# EAGLE design sdram_xxsd_1.0 (EAGLE 9.0.0)
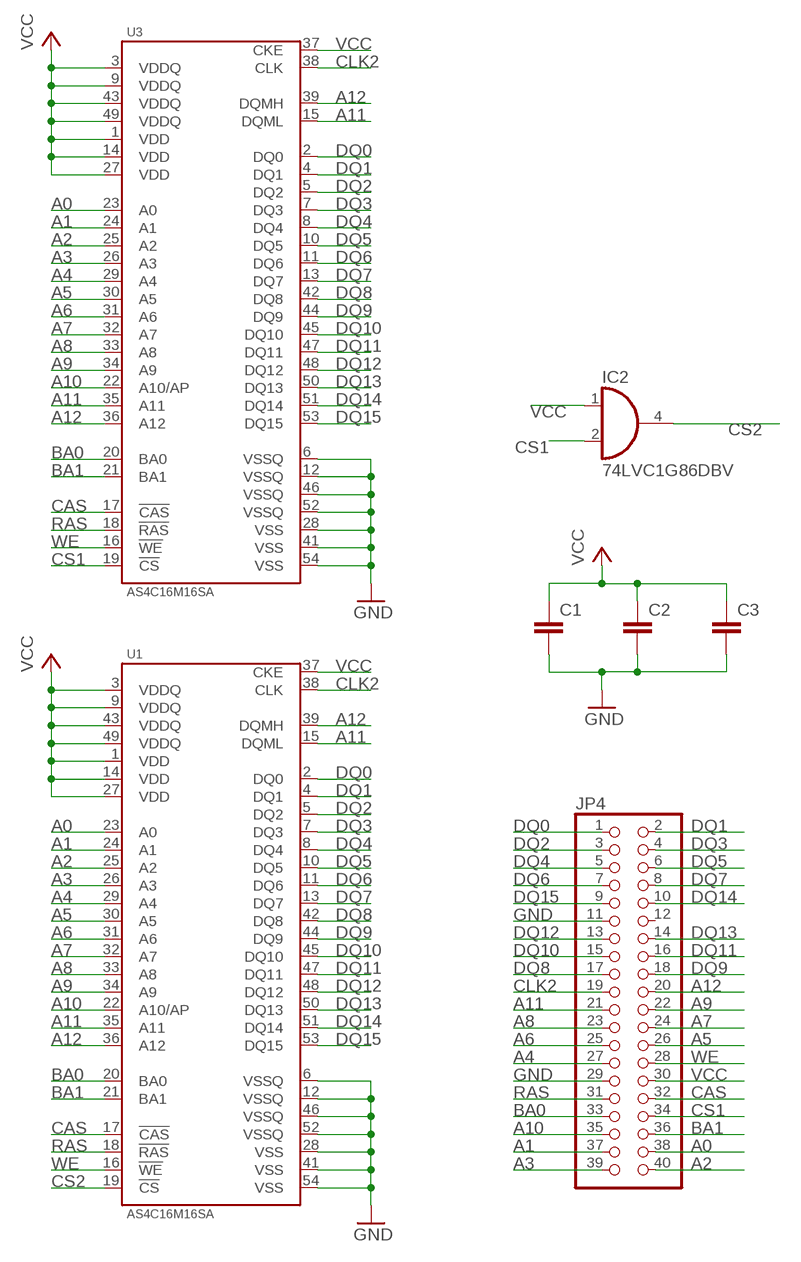
[diagram p0: schematic, sheet 1]

## Parts
C1  C-EUC0805K  [C0805K]
C2  C-EUC0805K  [C0805K]
C3  C-EUC0805K  [C0805K]
IC2  74LVC1G86DBV  74LVC1G08DBV  [SOT23-5]
JP4  PINHD-2X20_2.54-SMD  [2X20SMD]
U1  AS4C16M16SA  [TSOPII-54]
U3  AS4C16M16SA  [TSOPII-54]

## Nets
A0: JP4.38 U1.23(A0) U3.23(A0)
A1: JP4.37 U1.24(A1) U3.24(A1)
A2: JP4.40 U1.25(A2) U3.25(A2)
A3: JP4.39 U1.26(A3) U3.26(A3)
A4: JP4.27 U1.29(A4) U3.29(A4)
A5: JP4.26 U1.30(A5) U3.30(A5)
A6: JP4.25 U1.31(A6) U3.31(A6)
A7: JP4.24 U1.32(A7) U3.32(A7)
A8: JP4.23 U1.33(A8) U3.33(A8)
A9: JP4.22 U1.34(A9) U3.34(A9)
A10: JP4.35 U1.22(A10/AP) U3.22(A10/AP)
A11: JP4.21 U1.15(DQML) U1.35(A11) U3.15(DQML) U3.35(A11)
A12: JP4.20 U1.36(A12) U1.39(DQMH) U3.36(A12) U3.39(DQMH)
BA0: JP4.33 U1.20(BA0) U3.20(BA0)
BA1: JP4.36 U1.21(BA1) U3.21(BA1)
CAS: JP4.32 U1.17(!CAS) U3.17(!CAS)
CLK2 [power]: JP4.19 U1.38(CLK) U3.38(CLK)
CS1: IC2.2(I1) JP4.34 U3.19(!CS)
CS2: IC2.4(O) U1.19(!CS)
DQ0: JP4.1 U1.2(DQ0) U3.2(DQ0)
DQ1: JP4.2 U1.4(DQ1) U3.4(DQ1)
DQ2: JP4.3 U1.5(DQ2) U3.5(DQ2)
DQ3: JP4.4 U1.7(DQ3) U3.7(DQ3)
DQ4: JP4.5 U1.8(DQ4) U3.8(DQ4)
DQ5: JP4.6 U1.10(DQ5) U3.10(DQ5)
DQ6: JP4.7 U1.11(DQ6) U3.11(DQ6)
DQ7: JP4.8 U1.13(DQ7) U3.13(DQ7)
DQ8: JP4.17 U1.42(DQ8) U3.42(DQ8)
DQ9: JP4.18 U1.44(DQ9) U3.44(DQ9)
DQ10: JP4.15 U1.45(DQ10) U3.45(DQ10)
DQ11: JP4.16 U1.47(DQ11) U3.47(DQ11)
DQ12: JP4.13 U1.48(DQ12) U3.48(DQ12)
DQ13: JP4.14 U1.50(DQ13) U3.50(DQ13)
DQ14: JP4.10 U1.51(DQ14) U3.51(DQ14)
DQ15: JP4.9 U1.53(DQ15) U3.53(DQ15)
GND [power]: C1.2 C2.2 C3.2 JP4.11 JP4.29 U1.6(VSSQ) U1.12(VSSQ) U1.28(VSS) U1.41(VSS) U1.46(VSSQ) U1.52(VSSQ) U1.54(VSS) U3.6(VSSQ) U3.12(VSSQ) U3.28(VSS) U3.41(VSS) U3.46(VSSQ) U3.52(VSSQ) U3.54(VSS)
RAS: JP4.31 U1.18(!RAS) U3.18(!RAS)
VCC: C1.1 C2.1 C3.1 IC2.1(I0) JP4.30 U1.1(VDD) U1.3(VDDQ) U1.9(VDDQ) U1.14(VDD) U1.27(VDD) U1.37(CKE) U1.43(VDDQ) U1.49(VDDQ) U3.1(VDD) U3.3(VDDQ) U3.9(VDDQ) U3.14(VDD) U3.27(VDD) U3.37(CKE) U3.43(VDDQ) U3.49(VDDQ)
WE: JP4.28 U1.16(!WE) U3.16(!WE)
Unconnected: JP4.12

## Power pins joined to a net without a drawn wire
GND: IC2.3(GND)
VCC: IC2.5(VCC)

## Library data of the parts
C1-C3 = rcl:C-EU: CAPACITOR, European symbol
IC2 = 74xx-little-de:74*1G08: 2-input AND gate
JP4 = pinhead-2:PINHD-2X20: PIN HEADER
U1 U3 = AllianceMemory:AS4C16M16SA

## Net classes
0 default: width 0.178 mm, clearance 0.178 mm
1 power: width 0.305 mm, clearance 0.178 mm to class 0, clearance 0.229 mm

## Board
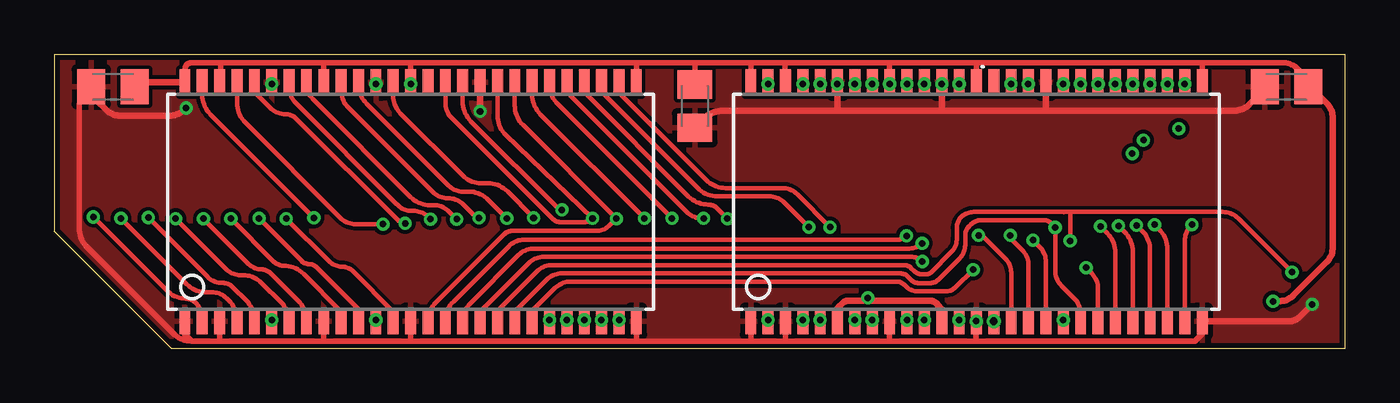
[diagram p1: board, top side]
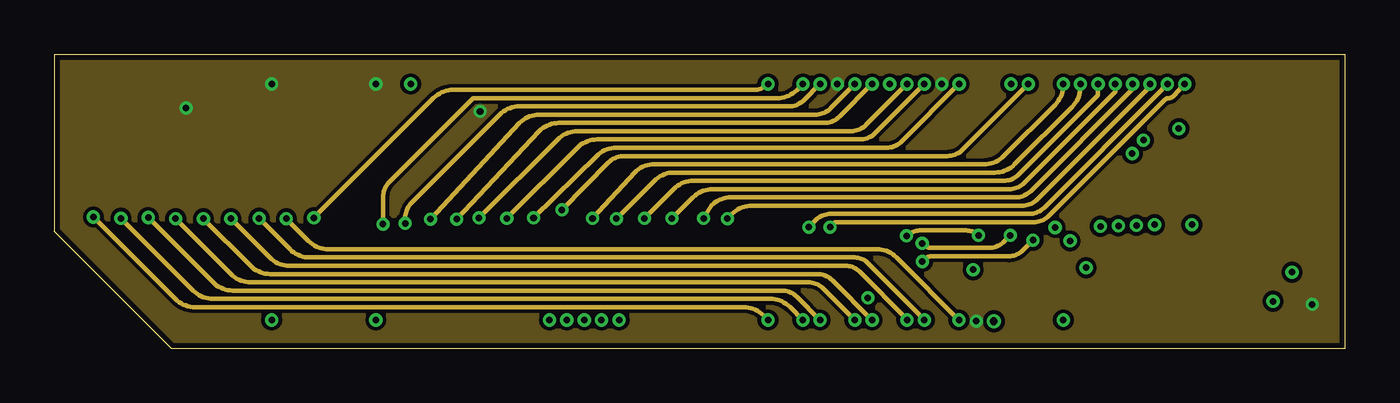
[diagram p2: board, inner layer Route2]
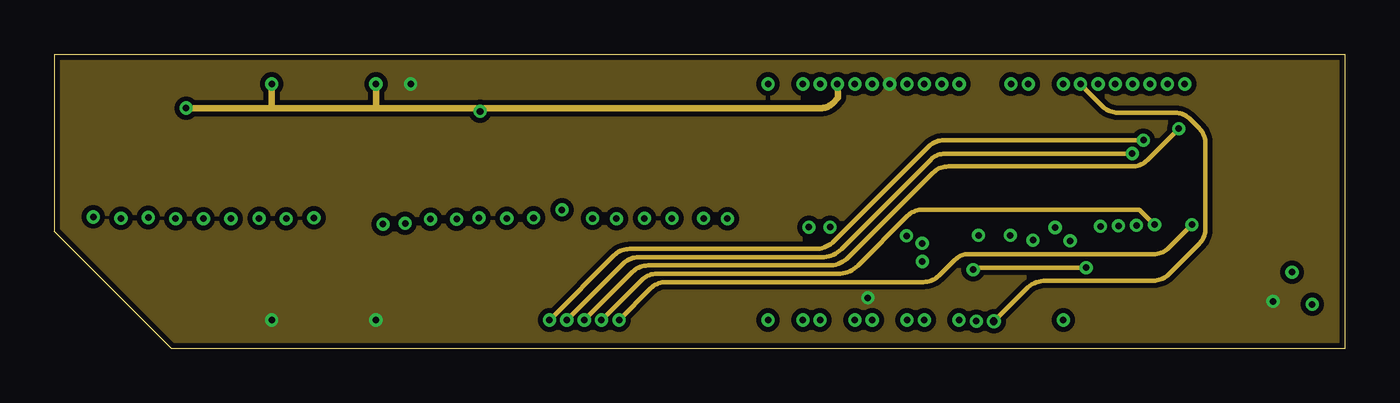
[diagram p3: board, inner layer Route15]
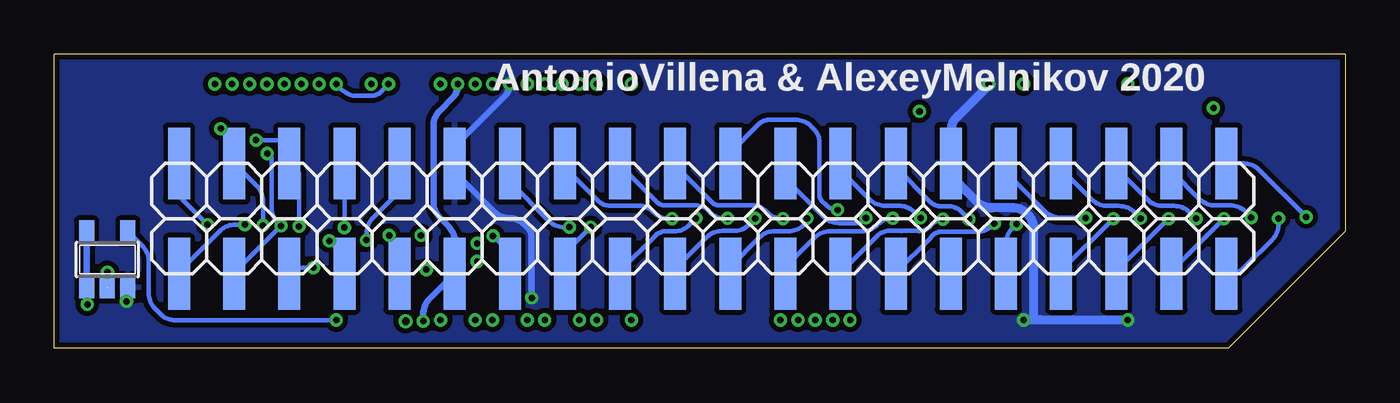
[diagram p4: board, bottom side, seen from below]

Size 59.49 x 13.55 mm. Coordinates in mm from the lower left corner, seen from the top.
Outline: 59.49,0 59.49,13.55 0,13.55 0,5.4 5.4,0 59.49,0
Copper layers (1*2*15*16): Top 0.035mm / dielectric 0.2mm / Route2 0.0175mm / dielectric 1.065mm / Route15 0.0175mm / dielectric 0.2mm / Bottom 0.035mm
Design rules "seedstudio_Fusion_eagle_rule_v1.1 *": minimum track width 6mil, minimum drill 12mil, track to track 6mil, track to pad 6mil, pad to pad 6mil, via to via 6mil, smd to smd 0mil, copper to edge 10mil, drill to drill 10mil, minimum pad ring 10mil, minimum via ring 6mil, stop-mask expansion 2mil, vias tented up to drill 100mil, thermal gap 10mil

### Footprints (pad centres in the part's own frame; a part is rotated, then mirrored left to right if it is on the bottom)
C0805K = smd 1.3 x 1.6: 1 -1,0; 2 1,0
SOT23-5 = smd 0.69 x 0.99: 1 -0.95,-1.29; 2 0,-1.29; 3 0.95,-1.29; 4 0.95,1.3; 5 -0.95,1.3
2X20SMD = smd 1.016 x 3.302: 1 -1.27,-3.81; 2 -1.27,1.27; 3 1.27,-3.81; 4 1.27,1.27; 5 3.81,-3.81; 6 3.81,1.27; 7 6.35,-3.81; 8 6.35,1.27; 9 8.89,-3.81; 10 8.89,1.27; 11 11.43,-3.81; 12 11.43,1.27; 13 13.97,-3.81; 14 13.97,1.27; 15 16.51,-3.81; 16 16.51,1.27; 17 19.05,-3.81; 18 19.05,1.27; 19 21.59,-3.81; 20 21.59,1.27; 21 24.13,-3.81; 22 24.13,1.27; 23 26.67,-3.81; 24 26.67,1.27; 25 29.21,-3.81; 26 29.21,1.27; 27 31.75,-3.81; 28 31.75,1.27; 29 34.29,-3.81; 30 34.29,1.27; 31 36.83,-3.81; 32 36.83,1.27; 33 39.37,-3.81; 34 39.37,1.27; 35 41.91,-3.81; 36 41.91,1.27; 37 44.45,-3.81; 38 44.45,1.27; 39 46.99,-3.81; 40 46.99,1.27
TSOPII-54 = smd 0.5 x 1.2: 1 -9.13,-6.772; 2 -8.33,-6.772; 3 -7.53,-6.772; 4 -6.73,-6.772; 5 -5.93,-6.772; 6 -5.13,-6.772; 7 -4.33,-6.772; 8 -3.53,-6.772; 9 -2.73,-6.772; 10 -1.93,-6.772; 11 -1.13,-6.772; 12 -0.33,-6.772; 13 0.47,-6.772; 14 1.27,-6.772; 15 2.07,-6.772; 16 2.87,-6.772; 17 3.67,-6.772; 18 4.47,-6.772; 19 5.27,-6.772; 20 6.07,-6.772; 21 6.87,-6.772; 22 7.67,-6.772; 23 8.47,-6.772; 24 9.27,-6.772; 25 10.07,-6.772; 26 10.87,-6.772; 27 11.67,-6.772; 28 11.67,4.232; 29 10.87,4.232; 30 10.07,4.232; 31 9.27,4.232; 32 8.47,4.232; 33 7.67,4.232; 34 6.87,4.232; 35 6.07,4.232; 36 5.27,4.232; 37 4.47,4.232; 38 3.67,4.232; 39 2.87,4.232; 40 2.07,4.232; 41 1.27,4.232; 42 0.47,4.232; 43 -0.33,4.232; 44 -1.13,4.232; 45 -1.93,4.232; 46 -2.73,4.232; 47 -3.53,4.232; 48 -4.33,4.232; 49 -5.13,4.232; 50 -5.93,4.232; 51 -6.73,4.232; 52 -7.53,4.232; 53 -8.33,4.232; 54 -9.13,4.232

### Placement (x,y rotation side)
C1  2.71,12.05 0 top
C2  56.78,12.05 0 top
C3  29.51,11.16 90 top
IC2  57.05,4.1 0 bottom
JP4  6.74,4.71 180 bottom
U1  41.22,8.03 0 top
U3  15.15,8.03 0 top

### Tracks (layer width: path | path; a pad name or v marks a point on that pad's centre or on a via)
A0  (via drill 0.3)
  Top 0.203: v49.04,5.65 49.32,5.36 arc-45 49.69,4.46 U1.23 | U3.23 23.62,1.3 arc45 v23.62,1.31
  Route15 0.203: v49.67,8.98 41.38,8.97 41.03,8.97 arc45 40.39,8.7 36.26,4.58 arc-45 35.36,4.2 26.92,4.2 arc45 26.22,3.91 v23.62,1.31
  Bottom 0.203: 49.04,5.6 v49.04,5.65 | v49.67,8.98 49.48,8.79 49.48,6.51 arc-45 49.19,5.8 v49.04,5.65 | v49.04,5.65 51.19,3.49 JP4.38
A1  (via drill 0.3)
  Top 0.203: v49.87,5.67 50.12,5.42 arc-45 50.49,4.52 U1.24 | U3.24 24.42,1.21 v24.42,1.31
  Route15 0.203: v51.82,10.12 50.37,8.68 arc-45 49.66,8.38 41.2,8.38 arc45 40.49,8.09 36.59,4.2 arc-45 35.69,3.82 27.35,3.82 arc45 26.64,3.53 v24.42,1.31
  Bottom 0.203: v51.82,10.12 51.19,9.5 JP4.37 50.16,7.49 arc45 49.87,6.78 v49.87,5.67
A2  (via drill 0.3)
  Top 0.203: v50.7,5.7 50.92,5.48 arc-45 51.29,4.58 U1.25 | 25.23,1.25 U3.25 v25.22,1.3 arc45 v25.22,1.31
  Route15 0.203: 25.23,1.23 v25.22,1.31 27.06,3.15 arc-45 27.76,3.44 36.13,3.44 arc45 37.02,3.81 39.32,6.11 arc-45 40.03,6.4 50,6.4 v50.7,5.7
  Bottom 0.203: JP4.40 53.73,3.54 51.87,5.41 arc45 51.16,5.7 v50.7,5.7
A3  (via drill 0.3)
  Top 0.203: U3.26 26.02,1.23 v26.02,1.31 | v52.42,5.7 52.39,5.66 arc45 52.09,4.96 U1.26
  Route15 0.203: v26.02,1.31 27.48,2.77 arc-45 28.19,3.06 40.06,3.06 arc45 40.77,3.35 41.51,4.09 arc-45 42.11,4.34 50.65,4.34 arc45 51.36,4.64 v52.42,5.7
  Bottom 0.203: JP4.39 53.73,7.01 v52.42,5.7
A4  (via drill 0.3)
  Top 0.203: U3.29 26.02,11.77 30.03,7.76 arc45 30.93,7.39 33.54,7.39 arc-45 34.25,7.1 v35.75,5.59 | U1.29 v52.09,12.18
  Route2 0.203: v52.09,12.18 51.88,11.96 51.88,11.94 51.54,11.61 | v35.75,5.59 35.98,5.82 45.13,5.82 arc45 45.83,6.11 51.18,11.46 arc-45 51.36,11.53 | 51.36,11.53 arc45 51.54,11.61 | 51.36,11.53 arc45 51.54,11.61
  Bottom 0.203: JP4.27 38.49,7.67 36.71,5.88 arc-45 36,5.59 v35.75,5.59
A5  (via drill 0.3)
  Top 0.203: U3.30 25.22,11.81 29.65,7.38 arc45 30.55,7.01 32.94,7.01 arc-45 33.65,6.71 v34.77,5.59 | U1.30 v51.29,12.18
  Route2 0.203: v51.29,12.18 51.07,11.96 51.07,11.94 45.62,6.49 arc-45 44.91,6.2 35.79,6.2 arc45 35.09,5.91 v34.77,5.59
  Bottom 0.203: JP4.26 35.95,4.41 v34.77,5.59
A6  (via drill 0.3)
  Top 0.203: v31.01,5.98 30.53,6.46 arc45 30.13,6.63 arc-45 29.24,7 24.42,11.81 U3.31 | 50.47,12.24 U1.31 v50.49,12.18
  Route2 0.203: v31.01,5.98 31.24,6.21 arc-45 32.14,6.58 44.59,6.58 arc45 45.3,6.87 50.49,12.06 v50.49,12.18
  Bottom 0.203: 35.95,8.27 JP4.25 35.95,8.33 34.42,6.8 arc-45 33.89,6.58 32.58,6.58 arc45 31.88,6.29 31.84,6.25 arc-45 31.19,5.98 v31.01,5.98
A7  (via drill 0.3)
  Top 0.203: v29.92,5.99 arc-45 29.2,6.23 23.89,11.54 23.89,11.55 23.62,11.82 U3.32 | 49.67,12.24 U1.32 49.69,12.25 v49.69,12.18
  Route2 0.203: v29.92,5.99 30.29,6.59 arc-45 31.18,6.96 44.29,6.96 arc45 45,7.25 49.69,11.94 v49.69,12.18
  Bottom 0.203: 29.92,6.01 v29.92,5.99 30.25,5.66 arc45 30.89,5.4 31.32,5.4 arc-45 31.77,5.21 33.41,3.57 JP4.24
A8  (via drill 0.3)
  Top 0.203: v28.46,5.99 23.19,11.26 arc-45 22.82,12.16 U3.33 | 48.88,12.24 U1.33 v48.89,12.18
  Route2 0.203: v28.46,5.99 29.43,6.97 arc-45 30.33,7.34 44,7.34 arc45 44.7,7.63 48.89,11.82 v48.89,12.18
  Bottom 0.203: JP4.23 33.41,8.43 31.72,6.74 arc-45 31.37,6.59 29.95,6.59 arc45 29.32,6.33 29.22,6.24 arc-45 28.64,5.99 v28.46,5.99
A9  (via drill 0.3)
  Top 0.203: v27.19,5.99 22.39,10.79 arc-45 22.02,11.69 U3.34 | 48.07,12.24 U1.34 v48.1,12.18
  Route2 0.203: v27.19,5.99 28.55,7.35 arc-45 29.44,7.72 43.74,7.72 arc45 44.45,8.01 48.1,11.66 v48.1,12.18
  Bottom 0.203: JP4.22 30.87,3.67 29.42,5.12 arc45 28.72,5.41 28.16,5.41 arc-45 27.5,5.68 v27.19,5.99
A10  (via drill 0.3)
  Top 0.203: v48.2,5.62 48.52,5.3 arc-45 48.89,4.41 U1.22 | U3.22 v22.82,1.31
  Route15 0.203: v50.19,9.59 40.99,9.59 arc45 40.29,9.3 35.94,4.95 arc-45 35.06,4.58 26.51,4.58 arc45 25.8,4.29 v22.82,1.31
  Bottom 0.203: v48.2,5.62 48.2,8.07 JP4.35 48.65,9.31 48.94,9.59 v50.19,9.59
A11  (via drill 0.3, 0.35)
  Top 0.203: 17.22,1.32 U3.15 arc-45 17.57,2.1 20.73,5.26 arc-45 21.09,5.41 21.1,5.42 24.39,5.42 24.4,5.41 24.97,5.41 arc45 25.6,5.67 v25.91,5.98 21.59,10.3 arc-45 21.22,11.2 U3.35 | U1.35 v47.29,12.18
  Route2 0.203: v25.91,5.98 27.66,7.73 arc-45 28.55,8.1 43.35,8.1 arc45 44.25,8.47 46.92,11.14 arc45 47.29,12.04 v47.29,12.18
  Route15 0.203: U1.15 44.79,2.75 arc-45 45.69,3.12 50.64,3.12 arc45 51.35,3.42 52.75,4.83 arc45 53.05,5.53 53.05,9.43 arc45 52.76,10.13 52.29,10.6 arc45 51.66,10.86 49.01,10.86 arc-45 48.3,11.15 47.51,11.94 47.51,11.96 v47.29,12.18
  Bottom 0.203: 30.8,8.43 30.87,8.43 JP4.21 arc-45 30.81,8.37 29.16,6.72 arc-45 28.85,6.59 | v25.91,5.98 25.97,5.98 arc45 26.63,6.25 26.71,6.34 arc-45 27.31,6.59 28.85,6.59 | 28.85,6.59 28.96,6.59
  other vias: 43.29,1.25
A12  (via drill 0.3)
  Top 0.203: U1.39 v44.09,12.18 | U1.36 v46.49,12.18 | U3.36 20.42,10.74 arc45 20.79,9.84 v24.8,5.99 arc-45 24.34,5.8 23.39,5.8 arc-45 22.94,5.99 18.31,10.62 arc-45 18.02,11.32 U3.39
  Route2 0.203: v24.8,5.99 26.76,8.11 arc-45 27.65,8.48 42.84,8.48 arc45 43.74,8.86 46.12,11.24 arc45 46.49,12.13 v46.49,12.18
  Bottom 0.203: 24.66,5.97 v24.8,5.99 24.94,5.69 arc45 25.65,5.4 26.31,5.4 arc-45 26.98,5.12 28.33,3.77 JP4.20 | 46.32,12.01 v46.49,12.18 46.24,11.93 arc-45 45.53,11.63 44.89,11.63 arc-45 44.4,11.84 44.11,12.12 arc-45 v44.09,12.18
BA0  (via drill 0.3)
  Top 0.203: U3.20 21.22,1.7 22.69,3.17 arc-45 23.4,3.46 38.96,3.46 arc-45 39.34,3.3 39.5,3.15 arc45 39.84,3.01 40.35,3.01 arc45 40.74,3.17 41.73,4.17 arc45 41.97,4.75 41.97,5.18 arc-45 42.16,5.64 42.24,5.71 arc-45 42.7,5.91 45.64,5.91 arc-45 45.89,5.8 v46.12,5.57 46.12,3.59 arc45 46.41,2.89 47,2.3 arc-45 47.29,1.59 U1.20
  Bottom 0.203: JP4.33 46.11,5.58 v46.12,5.57
BA1  (via drill 0.3)
  Top 0.203: U3.21 22.02,1.73 23.08,2.79 arc-45 23.79,3.08 38.82,3.08 arc-45 39.17,2.93 39.24,2.86 arc45 39.81,2.63 41.07,2.63 arc45 41.52,2.81 v42.34,3.63 | U1.21 48.09,2.76 arc45 47.8,3.47 v47.55,3.72
  Route15 0.203: v47.55,3.72 42.71,3.72 42.43,3.72 v42.34,3.63
  Bottom 0.203: 48.65,4.32 JP4.36 48.38,3.72 v47.55,3.72
CAS  (via drill 0.3)
  Top 0.203: U3.17 arc-45 19.16,2.06 21.4,4.31 arc-45 22.11,4.6 39.42,4.6 arc45 v39.99,4.84 | v44.05,5.21 44.05,5.08 44.6,4.54 arc-45 44.89,3.83 U1.17
  Route2 0.203: v39.99,4.84 40.02,4.81 arc45 40.46,4.63 43.06,4.63 arc45 43.76,4.92 v44.05,5.21
  Bottom 0.203: JP4.32 43.57,4.73 v44.05,5.21
CLK2  (via drill 0.3)
  Top 0.203: U3.38 18.82,11.37 arc45 19.19,10.47 23.28,6.39 v23.39,6.39 | U1.38 44.89,12.21 arc-45 v44.88,12.18
  Route2 0.203: v23.39,6.39 25.55,8.57 arc-45 26.26,8.87 41,8.87 41.04,8.87 41.15,8.87 arc45 41.86,9.16 v44.88,12.18
  Bottom 0.203: JP4.19 28.33,9.02 27.01,10.34 arc45 26.56,10.53 25.32,10.53 arc45 24.61,10.23 24.48,10.1 arc45 24.23,9.51 24.23,7.09 arc-45 24.1,6.78 23.94,6.61 arc-45 v23.39,6.39
CS1  (via drill 0.3)
  Top 0.203: U3.19 20.42,1.43 arc-45 20.63,1.94 22.24,3.55 arc-45 22.94,3.84 39.15,3.84 arc-45 39.48,3.71 39.63,3.55 arc45 39.96,3.42 40.17,3.42 arc45 40.41,3.52 41.33,4.43 arc45 41.59,5.08 41.59,5.57 arc-45 41.8,6.06 arc-45 42.35,6.29 46.52,6.29 | 46.52,6.29 46.8,6.29 | 46.53,6.27 46.52,6.29 | v46.81,4.95 46.81,6.27 46.8,6.29 | 46.8,6.29 53.85,6.29 arc-45 54.56,5.99 55.66,4.9 v57.04,3.52
  Bottom 0.203: v46.81,4.95 46.11,4.25 JP4.34 | v57.04,3.52 57.05,3.5 IC2.2
CS2  (via drill 0.3)
  Top 0.203: U1.19 v46.49,1.31
  Bottom 0.203: IC2.4 55.42,4.73 arc45 55.13,4.02 55.13,2.54 arc-45 54.84,1.83 54.55,1.54 arc-45 53.99,1.31 v46.49,1.31
DQ0  (via drill 0.3)
  Top 0.203: U1.2 32.89,1.2 v32.89,1.31 | U3.2 6.82,1.36 arc45 6.51,2.1 6.49,2.12 arc45 6.06,2.3 arc-45 5.21,2.65 v1.8,6.06
  Route2 0.203: 1.8,6.01 v1.8,6.06 5.58,2.28 arc45 6.48,1.91 31.77,1.91 arc-45 32.67,1.53 v32.89,1.31
  Bottom 0.203: JP4.1 4.68,8.52 arc45 3.97,8.23 v1.8,6.06
DQ1  (via drill 0.3)
  Top 0.203: U1.4 34.48,1.27 v34.49,1.31 | U3.4 8.42,1.3 arc45 8.05,2.2 7.94,2.31 arc45 7.26,2.59 7,2.59 arc-45 6.1,2.96 v3.07,5.99
  Route2 0.203: v3.07,5.99 6.41,2.66 arc45 7.31,2.29 32.99,2.29 arc-45 33.89,1.91 v34.49,1.31
  Bottom 0.203: v3.07,5.99 3.07,5.72 arc45 3.37,5.02 4.65,3.73 arc45 5.35,3.44 JP4.2
DQ2  (via drill 0.3)
  Top 0.203: U3.5 9.22,1.31 arc45 8.85,2.21 8.25,2.81 arc45 7.73,3.02 arc-45 7.06,3.3 v4.33,6.03 | v35.29,1.3 v35.29,1.31 35.29,1.27 arc45 U1.5
  Route2 0.203: v4.33,6.03 7.32,3.04 arc45 8.22,2.67 33.52,2.67 arc-45 34.22,2.37 v35.29,1.31 arc45 35.27,1.35
  Bottom 0.203: JP4.3 8.01,8.18 6.72,6.88 arc-45 6.01,6.59 5.3,6.59 arc45 4.6,6.3 v4.33,6.03
DQ3  (via drill 0.3)
  Top 0.203: U1.7 36.89,0.99 v36.89,1.31 | U3.7 arc45 10.47,2.1 9.54,3.04 arc45 8.71,3.38 8.59,3.38 arc-45 7.91,3.66 v5.59,5.98
  Route2 0.203: 36.91,1.27 v36.89,1.31 35.45,2.75 arc45 34.74,3.05 9.05,3.05 arc-45 8.15,3.42 v5.59,5.98
  Bottom 0.203: v5.59,5.98 8.01,3.56 JP4.4
DQ4  (via drill 0.3)
  Top 0.203: U3.8 11.62,1.29 arc45 11.25,2.19 9.96,3.47 arc45 9.55,3.65 arc-45 8.96,3.89 v6.87,5.98 | U1.8 v37.69,1.3 v37.69,1.31
  Route2 0.203: v6.87,5.98 9.05,3.8 arc45 9.95,3.43 35.16,3.43 arc-45 35.86,3.14 v37.69,1.31
  Bottom 0.203: JP4.5 10.55,8.31 9.1,6.86 arc-45 8.4,6.56 7.87,6.56 arc45 7.16,6.27 v6.87,5.98
DQ5  (via drill 0.3)
  Top 0.203: U3.10 13.22,1.7 11.48,3.44 arc45 10.58,3.81 arc-45 10.12,4 v8.14,5.98 | U1.10 39.28,1.3 v39.29,1.31
  Route2 0.203: v8.14,5.98 9.94,4.18 arc45 10.84,3.81 36.47,3.81 arc-45 37.09,3.55 39.29,1.35 v39.29,1.31
  Bottom 0.203: v8.14,5.98 10.55,3.57 JP4.6
DQ6  (via drill 0.3)
  Top 0.203: 14.02,1.7 U3.11 14.02,1.82 12.09,3.74 arc45 11.75,3.89 arc-45 11.4,4.03 v9.44,5.99 | U1.11 v40.09,1.3 v40.09,1.31
  Route2 0.203: v9.44,5.99 10.87,4.56 arc45 11.77,4.19 36.9,4.19 arc-45 37.48,3.95 39.88,1.55 39.88,1.52 v40.09,1.31
  Bottom 0.203: 9.42,6.01 v9.44,5.99 9.71,6.27 arc-45 10.42,6.57 10.96,6.57 arc45 11.67,6.86 13.09,8.28 JP4.7
DQ7  (via drill 0.3)
  Top 0.203: U3.13 15.62,1.7 13.76,3.56 arc45 13.25,3.77 arc-45 12.66,4.01 v10.69,5.98 | U1.13 41.68,1.27 v41.69,1.31
  Route2 0.203: v10.69,5.98 11.73,4.94 arc45 12.63,4.57 37.91,4.57 arc-45 38.8,4.2 38.94,4.06 v41.69,1.31
  Bottom 0.203: v10.69,5.98 13.09,3.58 JP4.8
DQ8  (via drill 0.3)
  Top 0.203: v22.09,6.02 20.88,7.24 arc45 19.98,7.61 19.66,7.61 arc-45 18.84,7.95 15.94,10.85 arc-45 15.62,11.61 U3.42 | U1.42 v41.69,12.18 | v41.69,12.18
  Route2 0.203: v22.09,6.02 25,8.87 arc-45 25.9,9.25 38.34,9.25 arc45 39.05,9.54 v41.69,12.18
  Bottom 0.203: JP4.17 25.79,7.82 24.02,6.05 arc-45 23.36,5.78 22.49,5.78 arc-45 22.21,5.89 v22.09,6.02
DQ9  (via drill 0.3)
  Top 0.203: v20.85,5.99 19.99,6.85 arc45 19.1,7.23 18.82,7.23 arc-45 18.17,7.5 14.39,11.27 arc-45 14.02,12.17 U3.44 | U1.44 v40.09,12.19 v40.09,12.18
  Route2 0.203: v20.85,5.99 24.11,9.26 arc-45 25.01,9.63 37.12,9.63 arc45 37.83,9.92 v40.09,12.18
  Bottom 0.203: JP4.18 25.79,3.77 24.46,5.11 arc45 23.75,5.4 22.25,5.4 arc-45 21.56,5.69 21.46,5.78 arc45 20.88,5.99 v20.85,5.99
DQ10  (via drill 0.3)
  Top 0.203: U3.45 13.22,11.87 arc45 13.54,11.1 17.43,7.21 arc45 18.12,6.92 18.15,6.92 arc-45 18.86,6.63 19.4,6.09 arc45 v19.57,6.02 | U1.45 v39.29,12.18
  Route2 0.203: v19.57,6.02 23.21,9.64 arc-45 24.11,10.01 36.7,10.01 arc45 37.41,10.3 v39.29,12.18
  Bottom 0.203: JP4.15 23.25,8.2 21.92,6.87 arc-45 21.21,6.58 20.89,6.58 20.57,6.58 arc45 19.86,6.28 v19.57,6.02
DQ11  (via drill 0.3)
  Top 0.203: U3.47 arc45 11.96,11.43 16.42,6.97 arc45 17.32,6.6 17.48,6.6 arc-45 18.19,6.31 v18.54,5.96 | U1.47 v37.69,12.19 v37.69,12.18
  Route2 0.203: v18.54,5.96 22.35,10.02 arc-45 23.25,10.39 35.48,10.39 arc45 36.19,10.68 v37.69,12.18
  Bottom 0.203: v18.54,5.96 arc-45 19.09,5.66 19.19,5.57 arc45 19.74,5.41 20.61,5.41 | 20.61,5.41 20.45,5.41 | 20.61,5.41 21.09,5.41 arc-45 21.63,5.12 23.21,3.54 arc-45 JP4.16
DQ12  (via drill 0.3)
  Top 0.203: U1.48 v36.89,12.18 | U3.48 10.82,12.02 arc45 11.11,11.31 15.78,6.65 arc45 15.8,6.64 15.87,6.57 arc45 16.43,6.34 16.54,6.34 arc-45 17.25,6.04 v17.34,5.96
  Route2 0.203: v17.34,5.96 21.45,10.4 arc-45 22.34,10.77 35.07,10.77 arc45 35.77,11.06 v36.89,12.18
  Bottom 0.203: JP4.13 20.71,8.34 19.11,6.74 arc-45 18.66,6.55 18.31,6.55 arc45 17.66,6.28 v17.34,5.96
DQ13  (via drill 0.3)
  Top 0.203: U1.50 v35.29,12.18 | v16.17,5.77 arc-45 15.84,5.9 11.15,10.59 arc45 10.65,10.79 arc-45 9.95,11.09 9.22,11.81 U3.50
  Route2 0.203: v16.17,5.77 16.17,6 arc-45 16.46,6.71 20.53,10.78 arc-45 21.43,11.15 33.85,11.15 arc45 34.55,11.44 v35.29,12.18
  Bottom 0.203: v16.17,5.77 16.27,5.67 arc45 16.97,5.37 18.72,5.37 arc-45 19.12,5.08 20.68,3.52 arc-45 JP4.14 | JP4.14 20.71,3.56 | 20.71,3.49 JP4.14
DQ14  (via drill 0.3)
  Top 0.203: U3.51 8.42,11.31 arc45 8.79,10.41 13.18,6.02 arc45 13.89,5.73 v15.15,5.73 | U1.51 v34.49,12.18
  Route2 0.203: v34.49,12.18 34.22,11.9 arc-45 33.32,11.53 19.3,11.53 15.44,7.68 arc45 15.15,6.97 v15.15,5.73
  Bottom 0.203: JP4.10 15.63,4.83 arc45 15.34,5.54 v15.15,5.73
DQ15  (via drill 0.3)
  Top 0.203: v11.96,6.02 7.19,10.79 arc-45 6.82,11.69 U3.53 | U1.53 v32.89,12.18
  Route2 0.203: v11.96,6.02 17.48,11.54 arc-45 18.38,11.91 32.24,11.91 arc45 v32.89,12.18
  Bottom 0.203: v11.96,6.02 13.12,6.02 arc45 13.83,6.31 15.35,7.83 arc45 JP4.9
GND  (via drill 0.3)
  Top 0.254: U3.54 6.02,12.84 arc-90 6.35,13.17 7.67,13.17 | 32.12,13.17 33.68,13.17 | 33.68,13.17 38.47,13.17 | 38.47,13.17 42.52,13.17 | 42.52,13.17 52.93,13.17 | U1.28 52.89,13.13 52.93,13.17 | U1.41 42.49,13.14 42.52,13.17 | U1.52 33.68,12.27 33.68,13.17 | U1.54 32.09,13.15 32.12,13.17 | 32.12,13.17 29.53,13.17 | 29.53,13.17 26.85,13.17 | 26.85,13.17 16.41,13.17 | 16.41,13.17 12.46,13.17 | 12.46,13.17 7.67,13.17 | U3.52 7.67,12.31 7.67,13.17 | U3.46 12.42,13.13 12.46,13.17 | v16.42,12.18 16.42,13.16 16.41,13.17 | U3.28 26.82,13.14 26.85,13.17 | C3.2 29.51,13.16 29.53,13.17 | U1.46 38.49,13.14 38.47,13.17 | C2.2 57.78,12.15 57.78,12.39 57.29,12.88 arc45 56.58,13.17 52.93,13.17
  Top 0.305: U3.12 v14.82,1.31 | U1.46 v38.49,12.18 | U3.41 v16.42,12.18 | 37.36,2.2 37.36,2.21 v37.49,2.33 | 37.36,2.2 40.37,2.2 arc-45 40.61,2.1 40.79,1.92 arc-45 40.89,1.67 U1.12 | 37.36,2.2 36.57,2.2 arc45 36.32,2.09 36.18,1.96 arc45 36.09,1.74 U1.6 | v56.16,2.17 56.42,2.17 arc45 57.12,2.46 58.62,3.96 arc45 58.92,4.67 58.92,10.61 arc45 58.62,11.31 57.78,12.15 | U3.54 4.2,12.26 arc45 C1.2
  Top 0.406: U3.6 v10.02,1.31
  Bottom 0.305: IC2.3 56.1,2.23 v56.16,2.17 | v37.49,2.33 37.49,5.1 arc-45 37.67,5.56 37.84,5.72 arc-45 38.53,6.01 38.54,6.01 arc45 39.19,6.28 41.03,8.12 JP4.29 41.03,9.31 38.73,11.61 arc-45 v38.49,12.18
  Bottom 0.406: v10.02,1.31 14.03,1.31 | 14.03,1.31 14.35,1.31 | 14.35,1.31 v14.82,1.31 | v16.42,12.18 16.42,12.13 17.88,10.67 arc-45 18.17,9.97 JP4.11 18.17,7.96 16.98,6.77 arc-45 16.27,6.47 15.31,6.47 arc45 14.64,6.2 arc45 14.35,5.49 14.35,1.31 | 14.03,1.31 14.06,1.34
  pour Bottom: 0.46,0.18 0.19,13.34 59.23,13.37 59.21,0.23
  pour Route15: 0.36,0.22 0.22,13.41 59.36,13.36 59.21,0.18
RAS  (via drill 0.3)
  Top 0.203: U3.18 19.62,1.32 arc-45 19.89,1.97 21.85,3.93 arc-45 22.56,4.22 39.48,4.22 arc-45 v40,4.01 | v45.09,4.99 45.41,4.67 arc-45 45.69,3.99 U1.18
  Route2 0.203: v45.09,4.99 44.61,4.5 arc-45 44,4.25 40.44,4.25 arc45 40.11,4.11 v40,4.01
  Bottom 0.203: JP4.31 43.57,7.25 44.8,6.02 arc-45 45.09,5.32 v45.09,4.99
VCC  (via drill 0.3)
  Top 0.203: U3.43 v14.82,12.18 | U3.49 v10.02,12.18
  Top 0.254: 6.32,0.34 7.59,0.34 | 7.59,0.34 12.41,0.34 | 12.41,0.34 16.48,0.34 | 16.48,0.34 26.8,0.34 | 26.8,0.34 32.16,0.34 | 32.16,0.34 33.74,0.34 | 33.74,0.34 38.51,0.34 | 38.51,0.34 42.47,0.34 | U1.14 42.47,1.23 42.47,0.34 | U1.9 38.49,0.35 38.51,0.34 | U1.3 33.69,0.39 33.74,0.34 | U1.1 32.09,0.41 32.16,0.34 | U3.27 26.82,0.37 26.8,0.34 | U3.9 12.42,0.36 12.41,0.34 | U3.3 7.62,0.37 7.59,0.34 | U3.14 16.42,0.41 16.48,0.34 | 42.47,0.34 52.57,0.34 52.89,0.67 U1.27 | 6.32,0.34 arc-45 5.48,0.69 1.51,4.66 arc-45 1.14,5.55 1.14,11.08 arc-45 1.44,11.78 C1.1 | U3.1 6.02,0.65 6.32,0.34
  Top 0.305: U1.9 38.49,1.31 | U1.43 v40.89,12.18 40.91,10.95 | U1.49 36.09,12.05 | 45.59,10.95 40.91,10.95 | 45.59,10.95 45.69,11.05 U1.37 | v36.09,12.18 36.09,12.05 | U3.37 v19.62,10.93 | C3.1 29.93,10.58 arc-45 30.83,10.95 36.04,10.95 | 36.04,10.95 40.91,10.95 | 36.04,10.95 arc45 36.09,11.07 36.09,12.05 | U1.14 v42.49,1.25 | C2.1 55.78,11.95 55.08,11.24 arc-45 54.37,10.95 45.59,10.95 | U1.27 56.9,1.25 arc45 57.39,1.46 v57.96,2.03 | v6.07,11.07 6.01,11.01 arc-45 5.3,10.72 3.06,10.72 arc-45 2.39,11 1.97,11.42 arc-45 C1.1
  Route15 0.305: v36.09,12.18 36.11,11.54 35.87,11.3 arc-45 35.31,11.06 19.62,11.06 | v6.07,11.07 6.08,11.06 10.05,11.06 | 19.62,11.06 14.85,11.06 | 14.85,11.06 10.05,11.06 | v10.02,12.18 10.02,11.09 10.05,11.06 | v14.82,12.18 14.82,11.09 14.85,11.06 | v19.62,10.93 19.62,11.06
  Bottom 0.305: IC2.5 IC2.1 58,2.07 v57.96,2.03 | v40.89,12.18 40.89,12.12 arc45 41.13,11.55 41.72,10.96 arc-45 42.01,10.25 42.01,6.73 arc-45 41.72,6.02 41.33,5.63 arc45 41.03,4.92 JP4.30 42.19,2.28 arc-45 42.49,1.57 v42.49,1.25
  pour Top: 0.33,0.13 0.22,13.26 59.21,13.3 59.22,0.2
  pour Route2: 0.28,0.1 0.25,13.3 59.25,13.26 59.26,0.27
WE  (via drill 0.3)
  Top 0.203: U3.16 18.02,1.26 arc-45 18.39,2.16 20.95,4.72 arc-45 21.65,5.01 38.84,5.01 arc45 v39.27,5.18 | U1.16 44.09,3.51 arc45 43.85,4.11 42.86,5.1 arc45 v42.59,5.21
  Route2 0.203: v39.27,5.18 arc-45 39.87,5.44 42.04,5.44 arc-45 v42.59,5.21
  Bottom 0.203: v39.27,5.18 38.49,4.41 JP4.28

### Text on the board
bPlace: AntonioVillena & AlexeyMelnikov 2020